# EAGLE schematic Node1 (EAGLE 7.7.0)
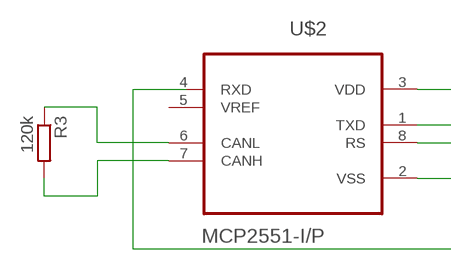
[diagram p0: schematic, sheet 1, part 1 of 2]
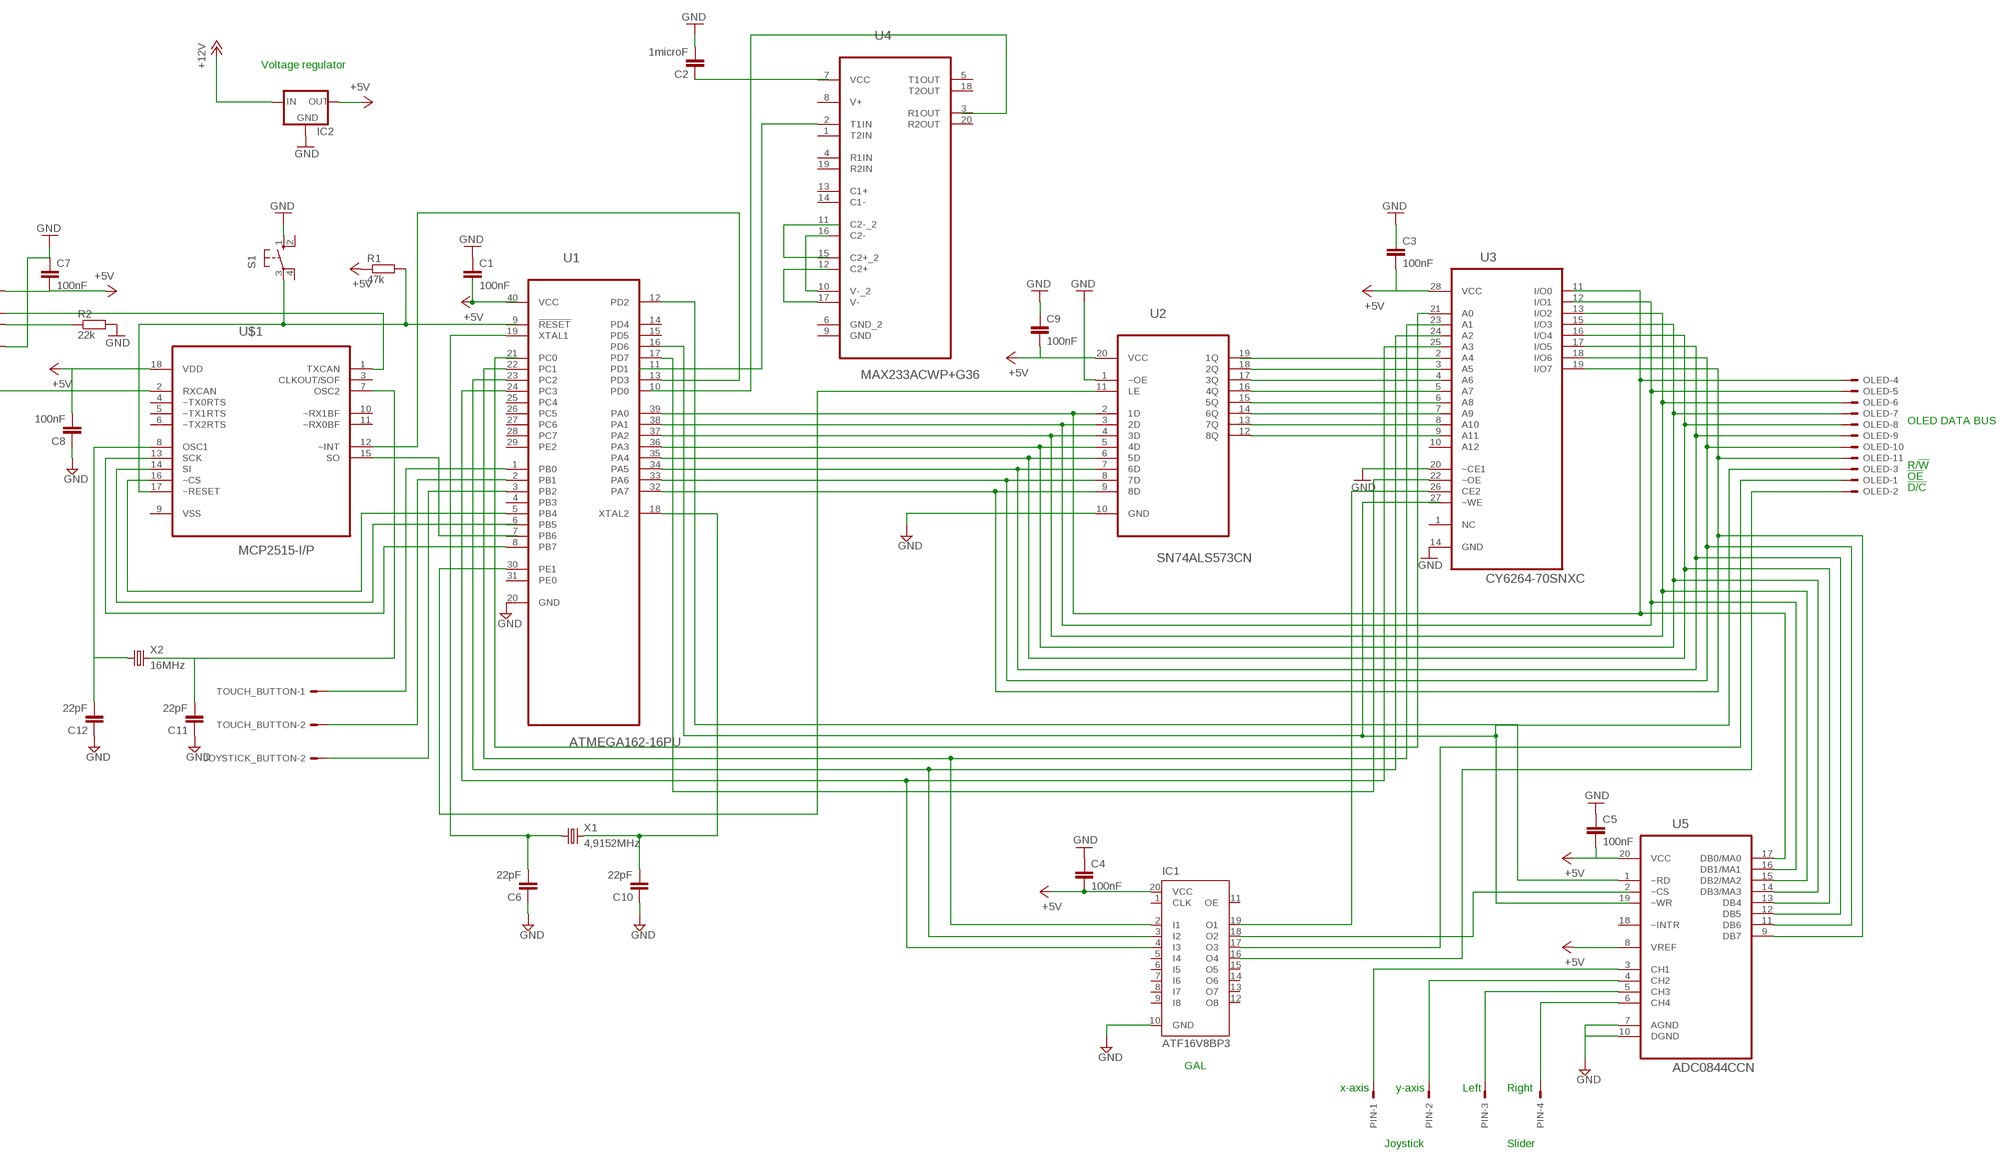
[diagram p1: schematic, sheet 1, part 2 of 2]

## Parts
C1  100nF  C-EU025-024X044  [C025-024X044]
C2  1microF  C-EU025-024X044  [C025-024X044]
C3  100nF  C-EU025-024X044  [C025-024X044]
C4  100nF  C-EU025-024X044  [C025-024X044]
C5  100nF  C-EU025-024X044  [C025-024X044]
C6  22pF  C-EU025-024X044  [C025-024X044]
C7  100nF  C-EU025-024X044  [C025-024X044]
C8  100nF  C-EU025-024X044  [C025-024X044]
C9  100nF  C-EU025-024X044  [C025-024X044]
C10  22pF  C-EU025-024X044  [C025-024X044]
C11  22pF  C-EU025-024X044  [C025-024X044]
C12  22pF  C-EU025-024X044  [C025-024X044]
IC1  ATF16V8BP3  [DIL20]
IC2  78XXL  [78XXL]
JOYSTICK_BUTTON  332-02  [332-02]
OLED  332-12  [332-12]
PIN  332-04  [332-04]
R1  47k  R-EU_0207/7  [0207/7]
R2  22k  R-EU_0207/7  [0207/7]
R3  120k  R-EU_0207/7  [0207/7]
S1  10-XX  [B3F-10XX]
TOUCH_BUTTON  332-02  [332-02]
U1  ATMEGA162-16PU  [DIP254P1524X483-40]
U2  SN74ALS573CN  [DIP254P762X508-20]
U3  CY6264-70SNXC  [SOIC127P1193X253-28N]
U4  MAX233ACWP+G36  [SOIC127P1032X265-20N]
U5  ADC0844CCN  [DIP254P762X508-20]
U$1  MCP2515-I/P  [DIP254P762X432-18]
U$2  MCP2551-I/P  [DIP254P762X432-8]
X1  4,9152MHz  CRYSTALS-NOGND-HC49/4H  [HC49]
X2  16MHz  CRYSTALS-NOGND-HC49/4H  [HC49]

## Nets
+5V: C3.2 C4.2 C5.2 C8.2 C9.2 IC1.20(VCC) IC2.OUT R1.1 U2.20(VCC) U3.28(VCC) U5.8(VREF) U5.20(VCC) U$1.18(VDD)
+12V: IC2.IN
GND: C1.1 C2.2 C4.1 C5.1 C6.1 C7.1 C9.1 C10.1 C11.1 C12.1 IC1.10(GND) IC2.GND R2.2 S1.1(S) U1.20(GND) U2.1(~OE) U2.10(GND) U3.14(GND) U3.20(~CE1) U5.7(AGND) U5.10(DGND) U$2.2(VSS)
N$1: OLED.4 U1.39(PA0) U2.2(1D) U5.17(DB0/MA0)
N$2: OLED.5 U1.38(PA1) U2.3(2D) U5.16(DB1/MA1)
N$3: OLED.6 U1.37(PA2) U2.4(3D) U3.13(I/O2) U5.15(DB2/MA2)
N$4: OLED.7 U1.36(PA3) U2.5(4D) U3.15(I/O3) U5.14(DB3/MA3)
N$5: OLED.8 U1.35(PA4) U2.6(5D) U3.16(I/O4) U5.13(DB4)
N$6: OLED.9 U1.34(PA5) U2.7(6D) U3.17(I/O5) U5.12(DB5)
N$7: OLED.10 U1.33(PA6) U2.8(7D) U3.18(I/O6) U5.11(DB6)
N$8: OLED.11 U1.32(PA7) U2.9(8D) U3.19(I/O7) U5.9(DB7)
N$9: U1.13(PD3) U$1.12(~INT)
N$10: U1.5(PB4) U$1.16(~CS)
N$11: U$1.14(SI)
N$12: U$1.15(SO)
N$13: U1.8(PB7) U$1.13(SCK)
N$14: R1.2 S1.3(P) U$1.17(~RESET)
N$15: U$1.1(TXCAN) U$2.1(TXD)
N$16: U$1.2(RXCAN)
N$18: U4.2(T1IN)
N$19: U4.17(V-)
N$21: R2.1 U$2.8(RS)
N$22: R3.1 U$2.6(CANL)
N$23: R3.2 U$2.7(CANH)
N$24: U3.21(A0)
N$25: IC1.2(I1) U1.22(PC1)
N$26: C7.2 U$2.3(VDD) ; supply symbol labelled +5V
N$28: C2.1
N$29: U4.10(V-_2)
N$31: U2.18(2Q)
N$32: U2.17(3Q)
N$33: U2.16(4Q)
N$34: U2.15(5Q)
N$35: U2.14(6Q)
N$36: U2.13(7Q)
N$37: U2.12(8Q)
N$38: IC1.3(I2) U1.23(PC2)
N$39: IC1.4(I3) U1.24(PC3)
N$40: U1.17(PD7) U3.22(~OE)
N$41: OLED.3 U1.16(PD6)
N$42: PIN.1 U5.3(CH1)
N$43: PIN.2 U5.4(CH2)
N$44: IC1.19(O1) U3.26(CE2)
N$45: IC1.18(O2)
N$46: PIN.3 U5.5(CH3)
N$47: PIN.4 U5.6(CH4)
N$48: C6.2 U1.19(XTAL1) X1.1
N$49: C10.2 U1.18(XTAL2) X1.2
N$50: JOYSTICK_BUTTON.2 U1.3(PB2)
N$51: U1.12(PD2) U5.1(~RD)
N$52: TOUCH_BUTTON.2 U1.2(PB1)
N$53: TOUCH_BUTTON.1 U1.1(PB0)
N$54: C12.2 U$1.8(OSC1) X2.1
N$55: C11.2 U$1.7(OSC2) X2.2
N$56: U1.30(PE1) U2.11(LE)
N$57: IC1.17(O3) OLED.1
N$58: IC1.16(O4) OLED.2
Unconnected: C1.2 C3.1 C8.1 IC1.1(CLK) IC1.5(I4) IC1.6(I5) IC1.7(I6) IC1.8(I7) IC1.9(I8) IC1.11(OE) IC1.12(O8) IC1.13(O7) IC1.14(O6) IC1.15(O5) JOYSTICK_BUTTON.1 OLED.12 S1.2(S1) S1.4(P1) U1.4(PB3) U1.6(PB5) U1.7(PB6) U1.9(!RESET) U1.10(PD0) U1.11(PD1) U1.14(PD4) U1.15(PD5) U1.21(PC0) U1.25(PC4) U1.26(PC5) U1.27(PC6) U1.28(PC7) U1.29(PE2) U1.31(PE0) U2.19(1Q) U3.1(NC) U3.2(A4) U3.3(A5) U3.4(A6) U3.5(A7) U3.6(A8) U3.7(A9) U3.8(A10) U3.9(A11) U3.10(A12) U3.11(I/O0) U3.12(I/O1) U3.23(A1) U3.24(A2) U3.25(A3) U3.27(~WE) U4.1(T2IN) U4.3(R1OUT) U4.4(R1IN) U4.5(T1OUT) U4.6(GND_2) U4.9(GND) U4.11(C2-_2) U4.12(C2+) U4.13(C1+) U4.14(C1-) U4.15(C2+_2) U4.16(C2-) U4.18(T2OUT) U4.19(R2IN) U4.20(R2OUT) U5.2(~CS) U5.18(~INTR) U5.19(~WR) U$1.3(CLKOUT/SOF) U$1.4(~TX0RTS) U$1.5(~TX1RTS) U$1.6(~TX2RTS) U$1.10(~RX1BF) U$1.11(~RX0BF) U$2.4(RXD) U$2.5(VREF)

## Notes on the sheet
- Voltage regulator
- OLED DATA BUS
- R/!W
- !OE
- !D/C
- GAL
- x-axis | y-axis | Left | Right
- Joystick | Slider

## Power pins joined to a net without a drawn wire
V+: U4.8(V+)
VCC: U1.40(VCC) U4.7(VCC)
VSS: U$1.9(VSS)

## Library data of the parts
C1-C12 = rcl:C-EU: CAPACITOR, European symbol
IC1 = atmel:ATF16V8B: High perfomance CMOS (electrically erasable) programmable logic device (PLD) ABLE-Atmel-ABEL - P18V8R, P16V8C, P16V8AS, P17V8 COPL Atmel-WinCUPL - G16V8MS, G16V8MA, G16V8AS, G16V8 LOG/IC - GAL16V8_R, GAL16V8_G7, GAL16V8_C), GAL16V8 Tango-PLD - G16V8R, G16V8C, G16V8AS, G16V8 Source: http://www.atmel.com/dyn/resources/prod_documents/DOC0364.PDF; MPN: ATF16V8CZ-15PU; OC_FARNELL: 1551768; OC_NEWARK: 94M6254
IC2 = v-reg:78XXL: VOLTAGE REGULATOR
JOYSTICK_BUTTON TOUCH_BUTTON = con-garry:332-02: 2 Pin - 2mm Dual Row Source: www.mpe-connector.de / garry_shortform_2012.pdf
OLED = con-garry:332-12: 12 Pin - 2mm Dual Row Source: www.mpe-connector.de / garry_shortform_2012.pdf
PIN = con-garry:332-04: 4 Pin - 2mm Dual Row Source: www.mpe-connector.de / garry_shortform_2012.pdf
R1-R3 = rcl:R-EU_: RESISTOR, European symbol
S1 = switch-omron:10-XX: OMRON SWITCH; MPN: B3F-1000; OC_FARNELL: 176432; OC_NEWARK: 36M3542
U1 = ATmega162-16PU:ATMEGA162-16PU: 8-bit Microcontroller with 16K Bytes In-System Programmable Flash,DIP-40; MPN: ATMEGA162-16PU; OC_FARNELL: 9171169; OC_NEWARK: 68T2610; PACKAGE: DIP-40; SUPPLIER: ATMEL
U2 = Texas Instruments_By_element14_Batch_1:SN74ALS573CN: OCTAL D-TYPE TRANSPARENT LATCHES; MPN: SN74ALS573CN; OC_FARNELL: 1105960; OC_NEWARK: 60K6796; PACKAGE: PDIP-20; SUPPLIER: Texas Instruments
U3 = Cypress_By_element14_Batch_1:CY6264-70SNXC: 8K x 8 Static RAM; DESCRIPTION: 8K x 8 Static RAM; MPN: CY6264-70SNXC; OC_FARNELL: 8911460; OC_NEWARK: 19M2607; PACKAGE: SOIC-28; SUPPLIER: CYPRESS SEMICONDUCTOR
U4 = Maxim_By_element14_Batch_1:MAX233ACWP+G36: +5V-Powered, Multichannel RS-232 Drivers/Receivers; MPN: MAX233ACWP+G36; OC_FARNELL: 2113687; OC_NEWARK: 95T9154; PACKAGE: SOIC-20; SUPPLIER: Maxim
U5 = NSC_By_element14_Batch_1.1:ADC0844CCN: A/D Converter with multiplexer; MPN: ADC0844CCN; OC_FARNELL: 9486623; OC_NEWARK: 07B4665; PACKAGE: DIP-20; SUPPLIER: National Semiconductor
U$1 = Microchip_By_element14_Batch_1:MCP2515-I/P: Stand-Alone CAN Controller; DESCRIPTION: CAN CONTRL; MPN: MCP2515-I/P; OC_FARNELL: 1439391; OC_NEWARK: 61K2945; PACKAGE: PDIP-18; SUPPLIER: MICROCHIP
U$2 = Microchip_By_element14_Batch_1:MCP2551-I/P: High-Speed CAN Transceiver; DESCRIPTION: CAN CTRL; MPN: MCP2551-I/P; OC_FARNELL: 1292240; OC_NEWARK: 61K2947; PACKAGE: PDIP-8; SUPPLIER: Microchip
X1 X2 = IQD-Frequency-Products:CRYSTALS-NOGND: CRYSTALS CAN NOT GROUNDED